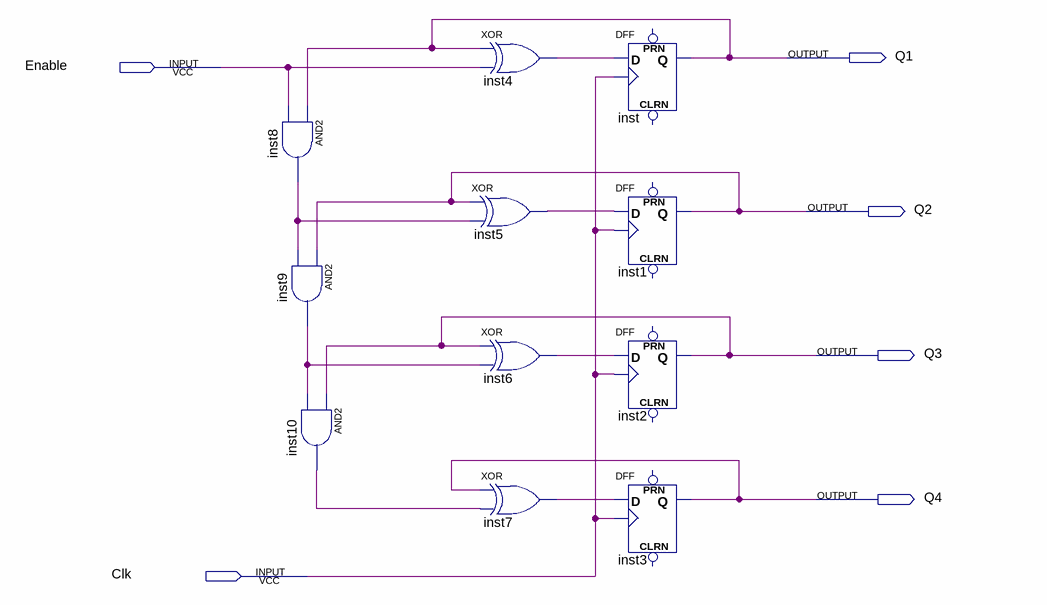
[diagram p0: schematic sheet]
// Quartus schematic lab10step2a.bdf as structural Verilog: 11 symbols, 6 pins
module lab10step2a (
  input  Enable,
  input  Clk,
  output Q1,
  output Q2,
  output Q3,
  output Q4
);

  wire inst4_out, inst5_out, inst6_out, inst7_out, inst8_out, inst9_out, inst10_out;

  and inst8 (inst8_out, Q1, Enable);
  and inst9 (inst9_out, Q2, inst8_out);
  and inst10 (inst10_out, Q3, inst9_out);
  xor inst4 (inst4_out, Q1, Enable);
  xor inst5 (inst5_out, Q2, inst8_out);
  xor inst6 (inst6_out, Q3, inst9_out);
  xor inst7 (inst7_out, Q4, inst10_out);
  DFF inst (.CLK(Clk), .D(inst4_out), .Q(Q1));  // open: CLRN, PRN
  DFF inst1 (.CLK(Clk), .D(inst5_out), .Q(Q2));  // open: CLRN, PRN
  DFF inst2 (.CLK(Clk), .D(inst6_out), .Q(Q3));  // open: CLRN, PRN
  DFF inst3 (.CLK(Clk), .D(inst7_out), .Q(Q4));  // open: CLRN, PRN
endmodule
